# Altium schematic sheet FDTI_converter_out.SchDoc
size A4; SheetNumber: 3; SheetTotal: 10
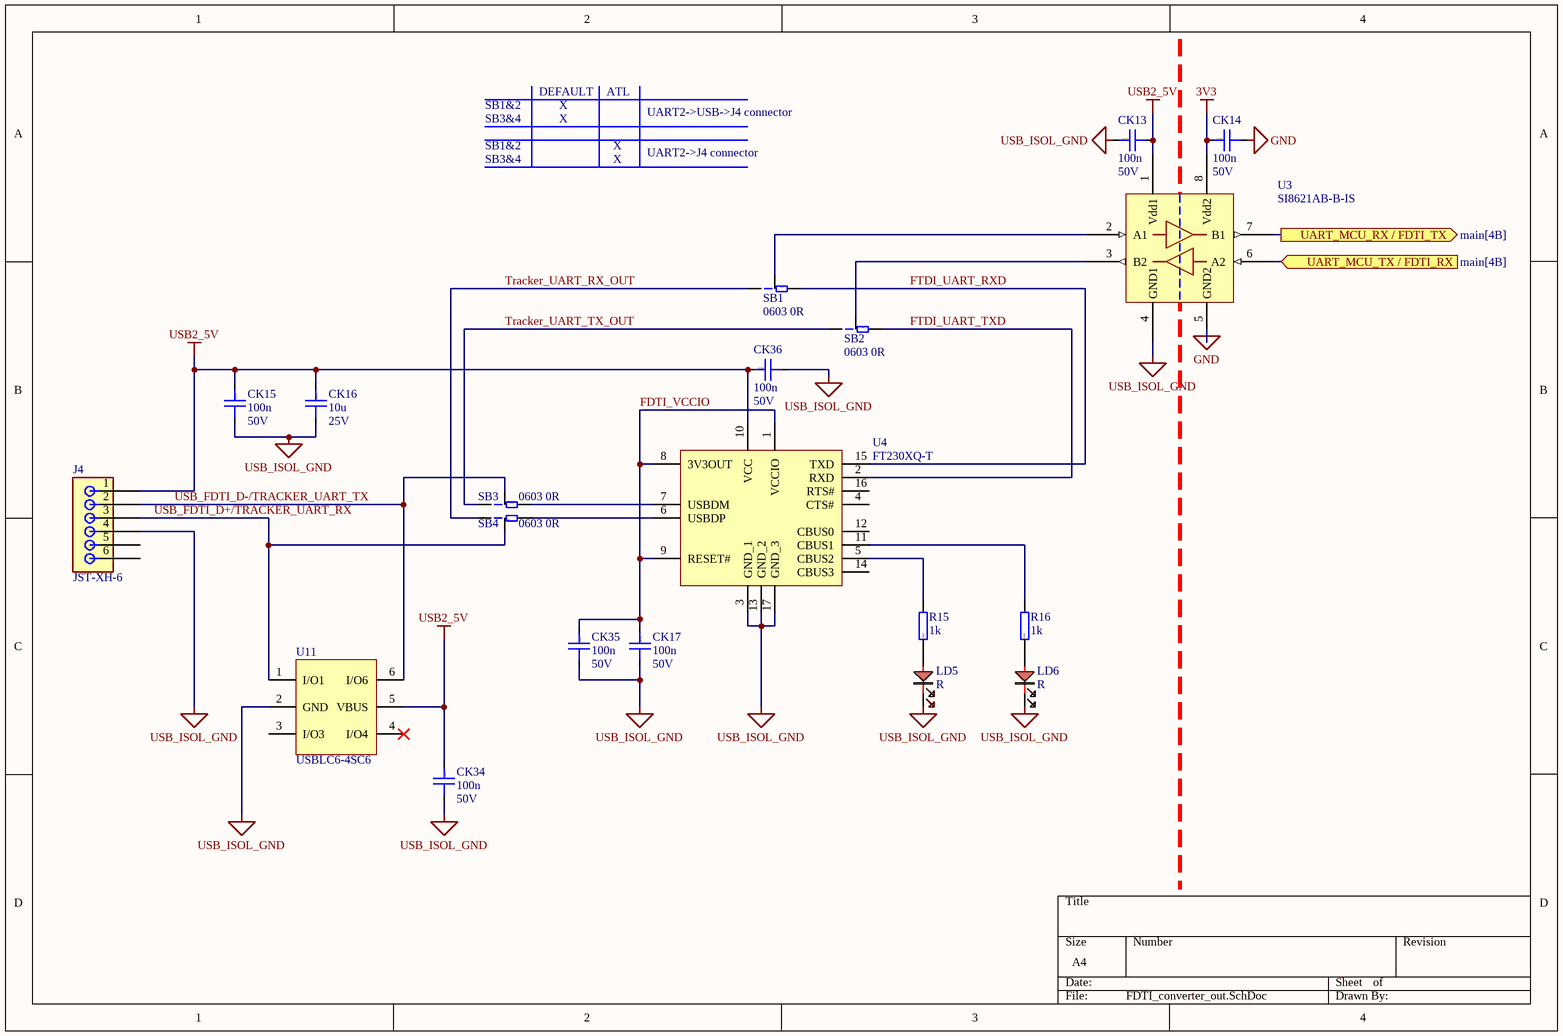
[diagram p0: FDTI_converter_out.SchDoc]

## Parts
CK13  100n  Voltage rating: 50V  [CAP0603]
CK14  100n  Voltage rating: 50V  [CAP0603]
CK15  100n  Voltage rating: 50V  [CAP0603]
CK16  10u  Voltage rating: 25V  [CAP0805]
CK17  100n  Voltage rating: 50V  [CAP0603]
CK34  100n  Voltage rating: 50V  [CAP0603]
CK35  100n  Voltage rating: 50V  [CAP0603]
CK36  100n  Voltage rating: 50V  [CAP0603]
J4  JST-XH-6  [JST-XH-6]
LD5  R  [0603_LED_R]
LD6  R  [0603_LED_R]
R15  1k  [RESC2012X06N(SMR0805)]
R16  1k  [RESC2012X06N(SMR0805)]
SB1  0603 0R  [Solder T bridge 0603]
SB2  0603 0R  [Solder T bridge 0603]
SB3  0603 0R  [Solder T bridge 0603]
SB4  0603 0R  [Solder T bridge 0603]
U3  SI8621AB-B-IS  [SOIC8]
U4  FT230XQ-T  [QFN65P400X400X80-17N]
U11  USBLC6-4SC6  [SOT23-6]

## Ports
UART_MCU_RX / FDTI_TX (out, see main[4B]), UART_MCU_TX / FDTI_RX (in, see main[4B])

## Nets
3V3: CK14.1 U3.8(Vdd2)
GND: CK14.2 U3.5(GND2)
USB2_5V: CK13.2 CK15.1 CK16.1 CK34.1 CK36.1 J4.1 U3.1(Vdd1) U4.10(VCC) U11.5(VBUS)
USB_ISOL_GND: CK13.1 CK15.2 CK16.2 CK17.2 CK34.2 CK35.2 CK36.2 J4.4 LD5.2 LD6.2 U3.4(GND1) U4.3(GND_1) U4.13(GND_2) U4.17(GND_3) U11.2(GND)
FDTI_VCCIO: CK17.1 CK35.1 U4.1(VCCIO) U4.8(3V3OUT) U4.9(RESET#)
FTDI_UART_RXD: SB1.3 U4.15(TXD)
FTDI_UART_TXD: SB2.3 U4.2(RXD)
Tracker_UART_RX_OUT: SB1.1 SB4.1
Tracker_UART_TX_OUT: SB2.1 SB3.1
UART_MCU_RX / FDTI_TX: U3.7(B1) ; port UART_MCU_RX / FDTI_TX
UART_MCU_TX / FDTI_RX: U3.6(A2) ; port UART_MCU_TX / FDTI_RX
USB_FDTI_D+/TRACKER_UART_RX: J4.3 SB4.2 U11.1(I/O1)
USB_FDTI_D-/TRACKER_UART_TX: J4.2 SB3.2 U11.6(I/O6)
NetLD5_1: LD5.1 R15.2
NetLD6_1: LD6.1 R16.2
NetR15_1: R15.1 U4.5(CBUS2)
NetR16_1: R16.1 U4.11(CBUS1)
NetSB1_2: SB1.2 U3.2(A1)
NetSB2_2: SB2.2 U3.3(B2)
NetSB3_3: SB3.3 U4.7(USBDM)
NetSB4_3: SB4.3 U4.6(USBDP)

Not connected (* = marked no-connect by the designer): J4 5 6; U4 4(CTS#) 12(CBUS0) 14(CBUS3) 16(RTS#); U11 3(I/O3) 4(I/O4)*

## Notes on the sheet
- SB1&2
- DEFAULT
- X
- ATL
- UART2->USB->J4 connector
- SB3&4
- UART2->J4 connector
- (in symbol 0R T-junction) 0R
- (in symbol Cap 10u 0805) 0805
- (in symbol Cap 100n 50V 0603) 0603
- (in symbol Cap 100n 0603) 0603

## Library data of the parts
CK13-CK15 CK17 CK35 CK36 = Cap 100n 50V 0603: 50V 100nF X7R ±10% 0603 Multilayer Ceramic Capacitors MLCC - SMD/SMT ROHS; Basic: Yes; Value: 100n; JLCPCB Part: C14663
CK16 = Cap 10u 0805: 25V 10uF X5R ±10% 0805 Multilayer Ceramic Capacitors MLCC - SMD/SMT ROHS; Basic: Yes; JLCPCB Part: C15850; Value: 10u
CK34 = Cap 100n 0603: 50V 100nF X7R ±10% 0603 Multilayer Ceramic Capacitors MLCC - SMD/SMT ROHS; Basic: Yes; Value: 100n; JLCPCB Part: C14663
J4 = JST-HX-6: 1x6P 6P XH Tin 6 -25℃~+85℃ 3A 1 2.5mm Brass Bend insert Push-Pull,P=2.5mm Wire To Board Connector ROHS; S6B-XH-A(LF)(SN); Basic: No; JLCPCB Part: C157919; TME Part: S6B-XH-A
LD5 LD6 = LED R 0603: -40℃~+85℃ Red 0603 LED Indication - Discrete ROHS; JLCPCB Part: C2286
R15 R16 = Res 1k 0805: 125mW Thick Film Resistors 150V ±100ppm/℃ ±1% 1kΩ 0805 Chip Resistor - Surface Mount ROHS; Tolerance & Rating: 1%/0.1W; Basic: Yes; Value: 1k; Package: 0805; Author: JP/27.03.2014; SMD: 1; ComponentLink3Description: rezistor čip; ComponentLink3URL: heliosgreen://v1/hegMT/5-MT/Classes(343)/Folders/OpenForm?RecordNumbers=[381513]; JLCPCB Part: C17513
SB1-SB4 = 0R T-junction: Basic: Yes; JLCPCB Part: C21189
U3 = SI8621AB-B-IS: SOIC-8 Digital Isolators ROHS; Basic: No; JLCPCB Part: C430265; TME Part: SI8621AB-B-IS
U4 = FT230XQ-T: Integrated Circuit; Manufacturer_Name: FTDI Chip; Basic: No; Datasheet Link: https://www.ftdichip.com/Support/Documents/DataSheets/ICs/DS_FT230X.pdf; Height: 0.8mm; Manufacturer_Part_Number: FT230XQ-T; Mouser Part Number: 895-FT230XQ-T; Mouser Price/Stock: https://www.mouser.co.uk/ProductDetail/FTDI/FT230XQ-T?qs=Gp1Yz1mis3UQjzUa74hRVg%3D%3D; Arrow Part Number: FT230XQ-T; Arrow Price/Stock: https://www.arrow.com/en/products/ft230xq-t/ftdi-chip?region=europe; JLCPCB Part: C3216402; TME Part: FT230XQ-T
U11 = USBLC6-4SC6: 5A 17V 6V Unidirectional 5.25V SOT-23-6 ESD and Surge Protection (TVS/ESD) ROHS; Basic: No; JLCPCB Part: C111212; TME Part: USBLC6-4SC6